# Altium schematic sheet DISPLAY_INTERFACE.SchDoc
size A4; SheetNumber: 10; SheetTotal: 16
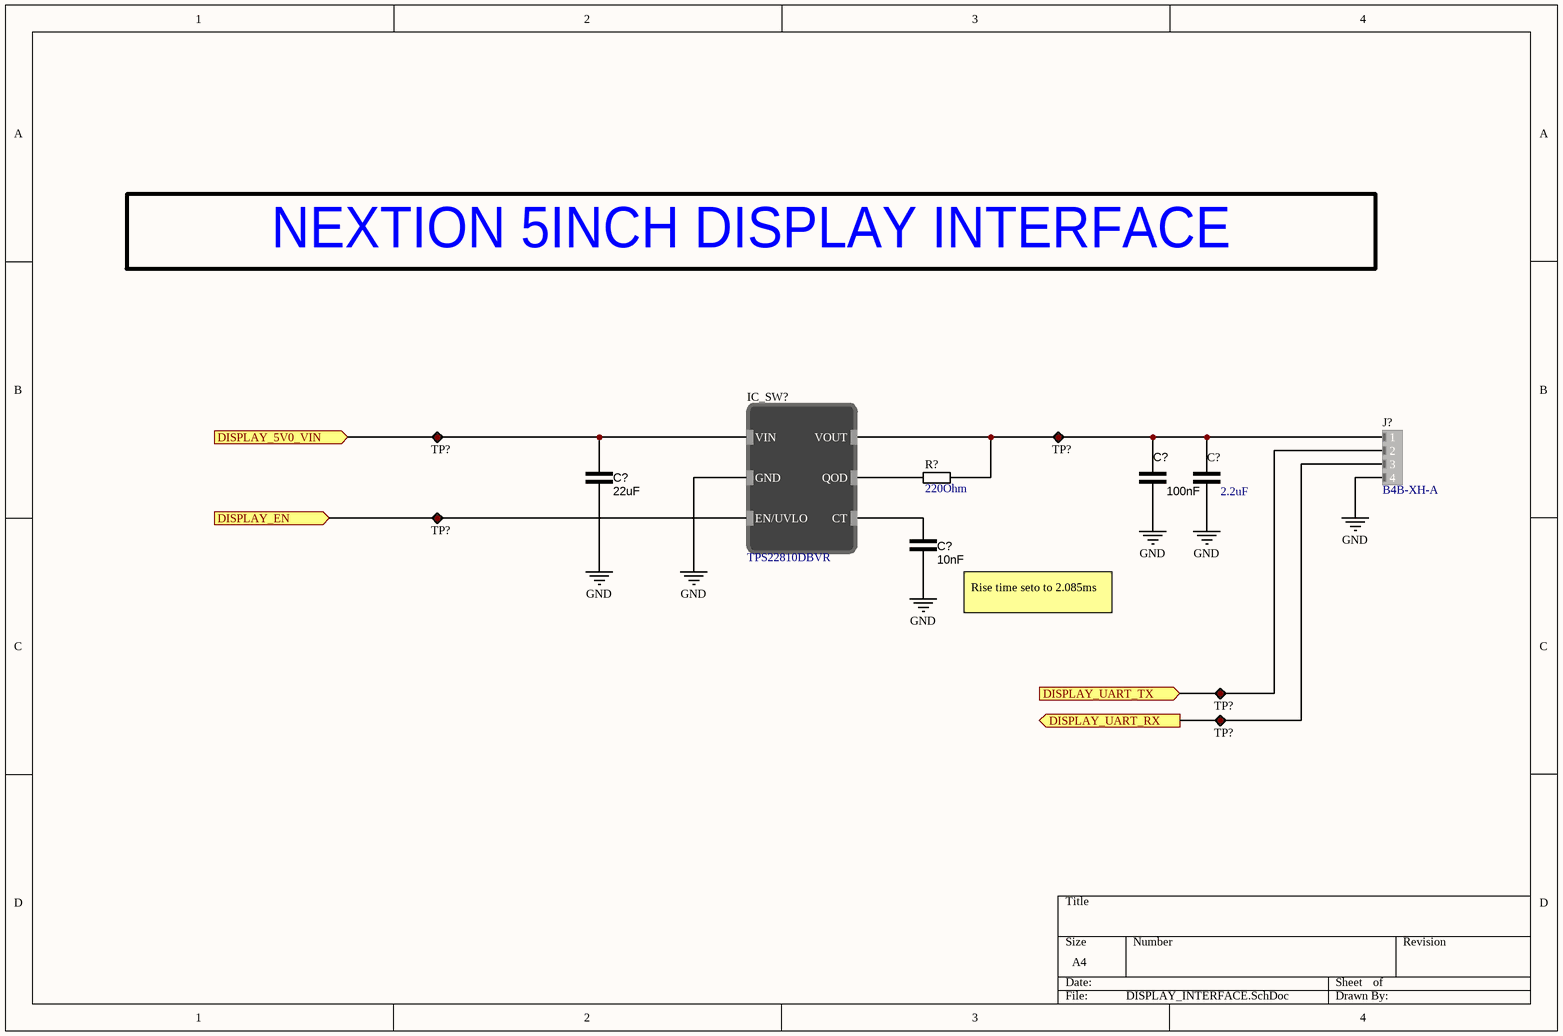
[diagram p0: DISPLAY_INTERFACE.SchDoc]

## Parts
(Parts that share a designator on the sheet are numbered #1, #2 ... from top to bottom, then left to right.)
C?#1  22uF  [CAP_0805]
C?#2  100nF  [CAP_0603]
C?#3  2.2uF  [CAP_0603]
C?#4  10nF  [CAP_0603]
IC_SW?  TPS22810DBVR  [SOT95P280X145-6N]
J?  B4B-XH-A  [JST_XH_4POS]
R?  220Ohm  [RES_0603]
TP?#1  Test point  [TestPoint]  (value not drawn)
TP?#2  Test point  [TestPoint]  (value not drawn)
TP?#3  Test point  [TestPoint]  (value not drawn)
TP?#4  Test point  [TestPoint]  (value not drawn)
TP?#5  Test point  [TestPoint]  (value not drawn)

## Ports
DISPLAY_5V0_VIN (in), DISPLAY_EN (in), DISPLAY_UART_RX (out), DISPLAY_UART_TX (in)

## Nets
GND: C?#1.1 C?#2.2 C?#3.1 C?#4.1 IC_SW?.2(GND) J?.4
DISPLAY_5V0_VIN: C?#1.2 IC_SW?.1(VIN) TP?#1.1 ; port DISPLAY_5V0_VIN
DISPLAY_EN: IC_SW?.3(EN/UVLO) TP?#3.1 ; port DISPLAY_EN
DISPLAY_UART_RX: J?.3 TP?#5.1 ; port DISPLAY_UART_RX
DISPLAY_UART_TX: J?.2 TP?#4.1 ; port DISPLAY_UART_TX
NetC?#2_1: C?#2.1 C?#3.2 IC_SW?.6(VOUT) J?.1 R?.2 TP?#2.1
NetC?#4_2: C?#4.2 IC_SW?.4(CT)
NetIC_SW?_5: IC_SW?.5(QOD) R?.1

## Notes on the sheet
- NEXTION 5INCH DISPLAY INTERFACE
- (near C?#4) Rise time seto to 2.085ms

## Library data of the parts
C?#1 = C000001: 22 µF ±20% 25V Ceramic Capacitor X5R 0805 (2012 Metric); ComponentLink1Description: DigiKey; ComponentLink1URL: https://www.digikey.com/en/products/detail/tdk-corporation/C2012X5R1E226M125AC/3661564; DigiKey Part Number: 445-9112-1-ND; capacitance: 22uF
C?#2 = C000007: 0.1 µF ±10% 25V Ceramic Capacitor X7R 0603 (1608 Metric); ComponentLink1Description: DigiKey; ComponentLink1URL: https://www.digikey.com/en/products/detail/kyocera-avx/06033C104K4T2A/8019250; DigiKey Part Number: 478-KAM15AR71E104KTCT-ND; capacitance: 100nF
C?#3 = C000014: 8 pF ±0.05pF 25V Ceramic Capacitor C0G, NP0 01005 (0402 Metric); ComponentLink1Description: DigiKey; ComponentLink1URL: https://www.digikey.com/en/products/detail/murata-electronics/GRM188C71C225KE11D/4905311; DigiKey Part Number: 490-12731-1-ND; capacitance: 2.2uF
C?#4 = C000005: 10000 pF ±20% 25V Ceramic Capacitor X7R 0603 (1608 Metric); ComponentLink1Description: DigiKey; ComponentLink1URL: https://www.digikey.com/en/products/detail/kyocera-avx/06033C103MAT2A/1599370; DigiKey Part Number: 478-KGM15AR71E103MTCT-ND; capacitance: 10nF
IC_SW? = TPS22810: Power Switch/Driver 1:1 N-Channel 2A SOT-23-6; DigiKey Part Number: 296-45297-1-ND; Mouser Part Number: 595-TPS22810DBVR; ComponentLink1Description: DigiKey; ComponentLink1URL: https://www.digikey.com/en/products/detail/texas-instruments/TPS22810DBVR/6595640; ComponentLink2Description: Mouser; ComponentLink2URL: https://eu.mouser.com/ProductDetail/Texas-Instruments/TPS22810DBVR?qs=34RfhUjJmKcFqeJVMZZhPA%3D%3D
J? = 00000014: Connector Header Through Hole 4 position 0.098" (2.50mm); DigiKey Part Number: 455-B4B-XH-A-ND; ComponentLink1Description: DigiKey; ComponentLink1URL: https://www.digikey.com/en/products/detail/jst-sales-america-inc/B4B-XH-A/1651047
R? = R000021: 220 Ohms ±5% 0.1W, 1/10W Chip Resistor 0603 (1608 Metric) Automotive AEC-Q200 Thick Film; ComponentLink1Description: DigiKey; ComponentLink1URL: https://www.digikey.com/en/products/detail/panasonic-electronic-components/ERJ-3GEYJ221V/135719; resistance: 220Ohm; DigiKey Part Number: P220GCT-ND
TP?#1-TP?#5 = TP002: Test point 1mm